# Altium schematic sheet ArduinoKeyboard.SchDoc
size A
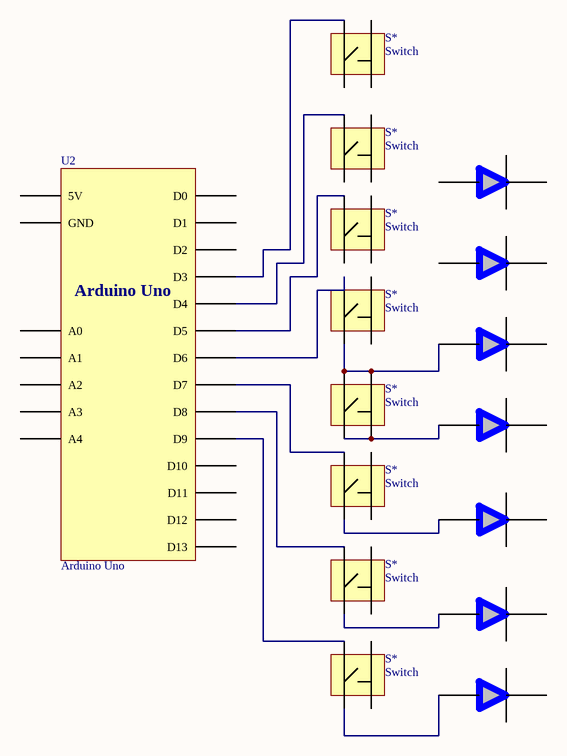
[diagram p0: ArduinoKeyboard.SchDoc]

## Parts
(Parts that share a designator on the sheet are numbered #1, #2 ... from top to bottom, then left to right.)
*#1  LED  (value not drawn)
*#2  LED  (value not drawn)
*#3  LED  (value not drawn)
*#4  LED  (value not drawn)
*#5  LED  (value not drawn)
*#6  LED  (value not drawn)
*#7  LED  (value not drawn)
S*#1  Switch
S*#2  Switch
S*#3  Switch
S*#4  Switch
S*#5  Switch
S*#6  Switch
S*#7  Switch
S*#8  Switch
U2  Arduino Uno

## Nets
Net*#3_33: *#3.33 S*#4.31 S*#5.29 S*#5.30
Net*#4_33: *#4.33 S*#5.31 S*#5.32
Net*#5_33: *#5.33 S*#6.31
Net*#6_33: *#6.33 S*#7.31
Net*#7_33: *#7.33 S*#8.31
NetS*#1_29: S*#1.29 U2.10(D3)
NetS*#2_29: S*#2.29 U2.11(D4)
NetS*#3_29: S*#3.29 U2.12(D5)
NetS*#4_29: S*#4.29 U2.13(D6)
NetS*#6_29: S*#6.29 U2.14(D7)
NetS*#7_29: S*#7.29 U2.15(D8)
NetS*#8_29: S*#8.29 U2.16(D9)

Not connected (* = marked no-connect by the designer): *#1 33 34; *#2 33 34; *#3 34; *#4 34; *#5 34; *#6 34; *#7 34; S*#1 30 31 32; S*#2 30 31 32; S*#3 30 31 32; S*#4 30 32; S*#6 30 32; S*#7 30 32; S*#8 30 32; U2 1(5V) 2(GND) 3(A1) 4(A2) 5(A3) 6(A4) 7(D0) 8(D1) 9(D2) 17(D10) 18(D11) 19(D13)